# EAGLE design schematic (EAGLE 9.5.2)
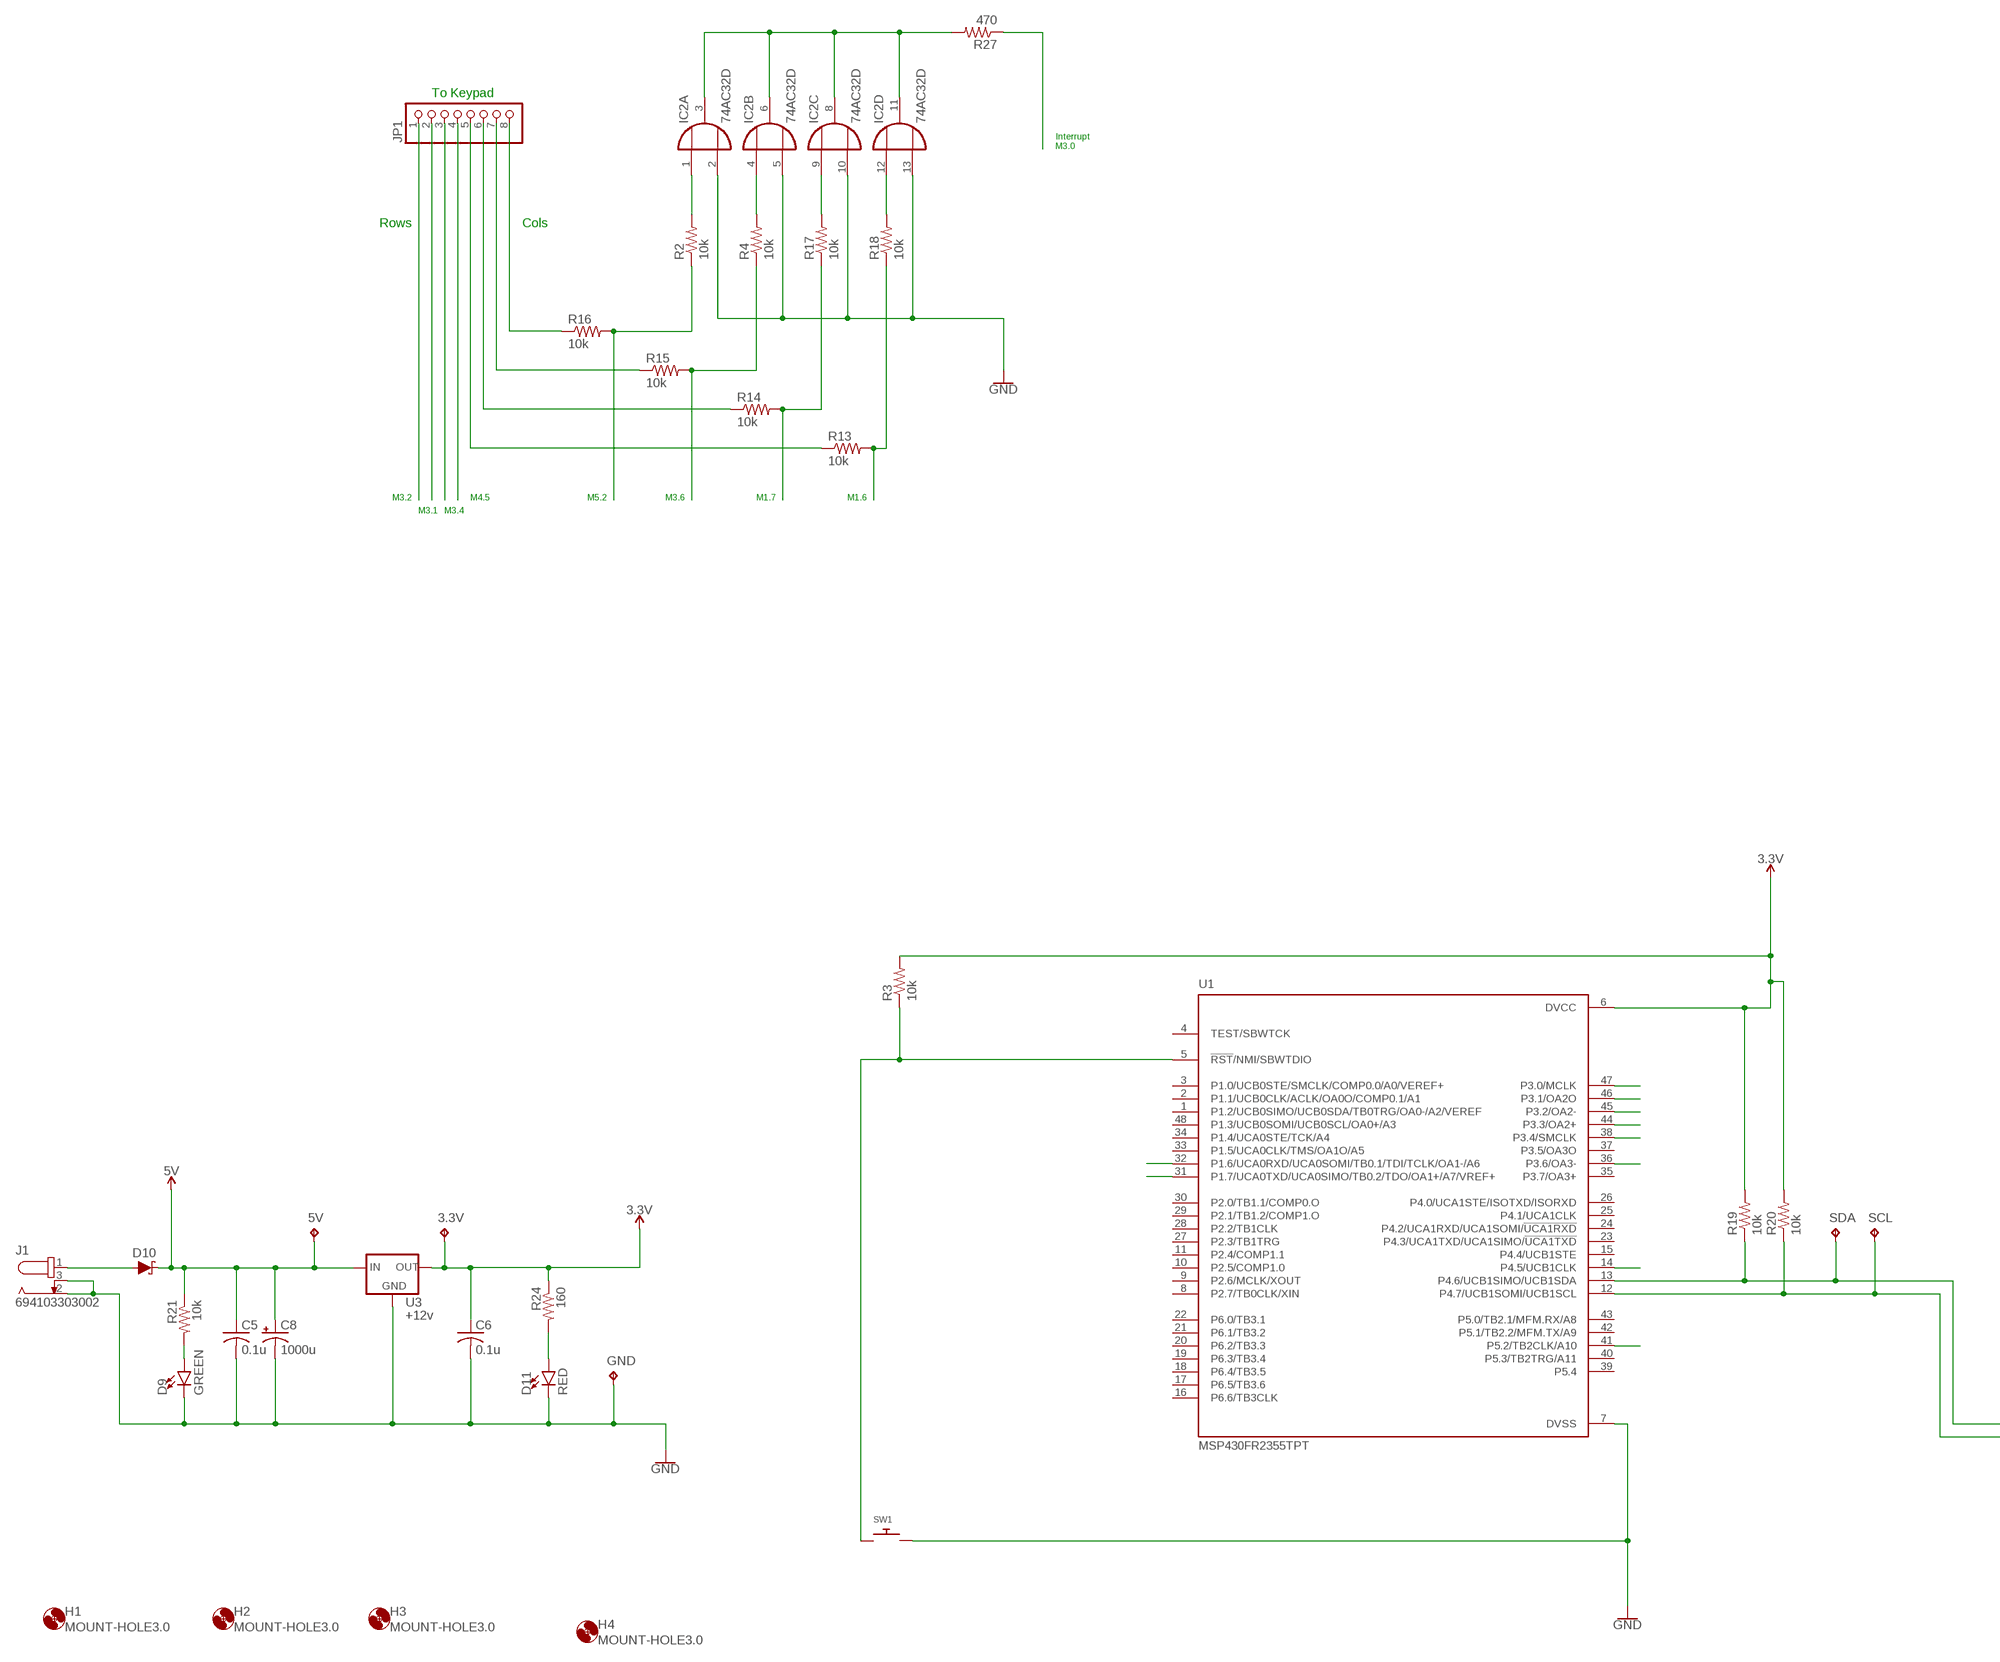
[diagram p0: schematic, sheet 1, part 1 of 2]
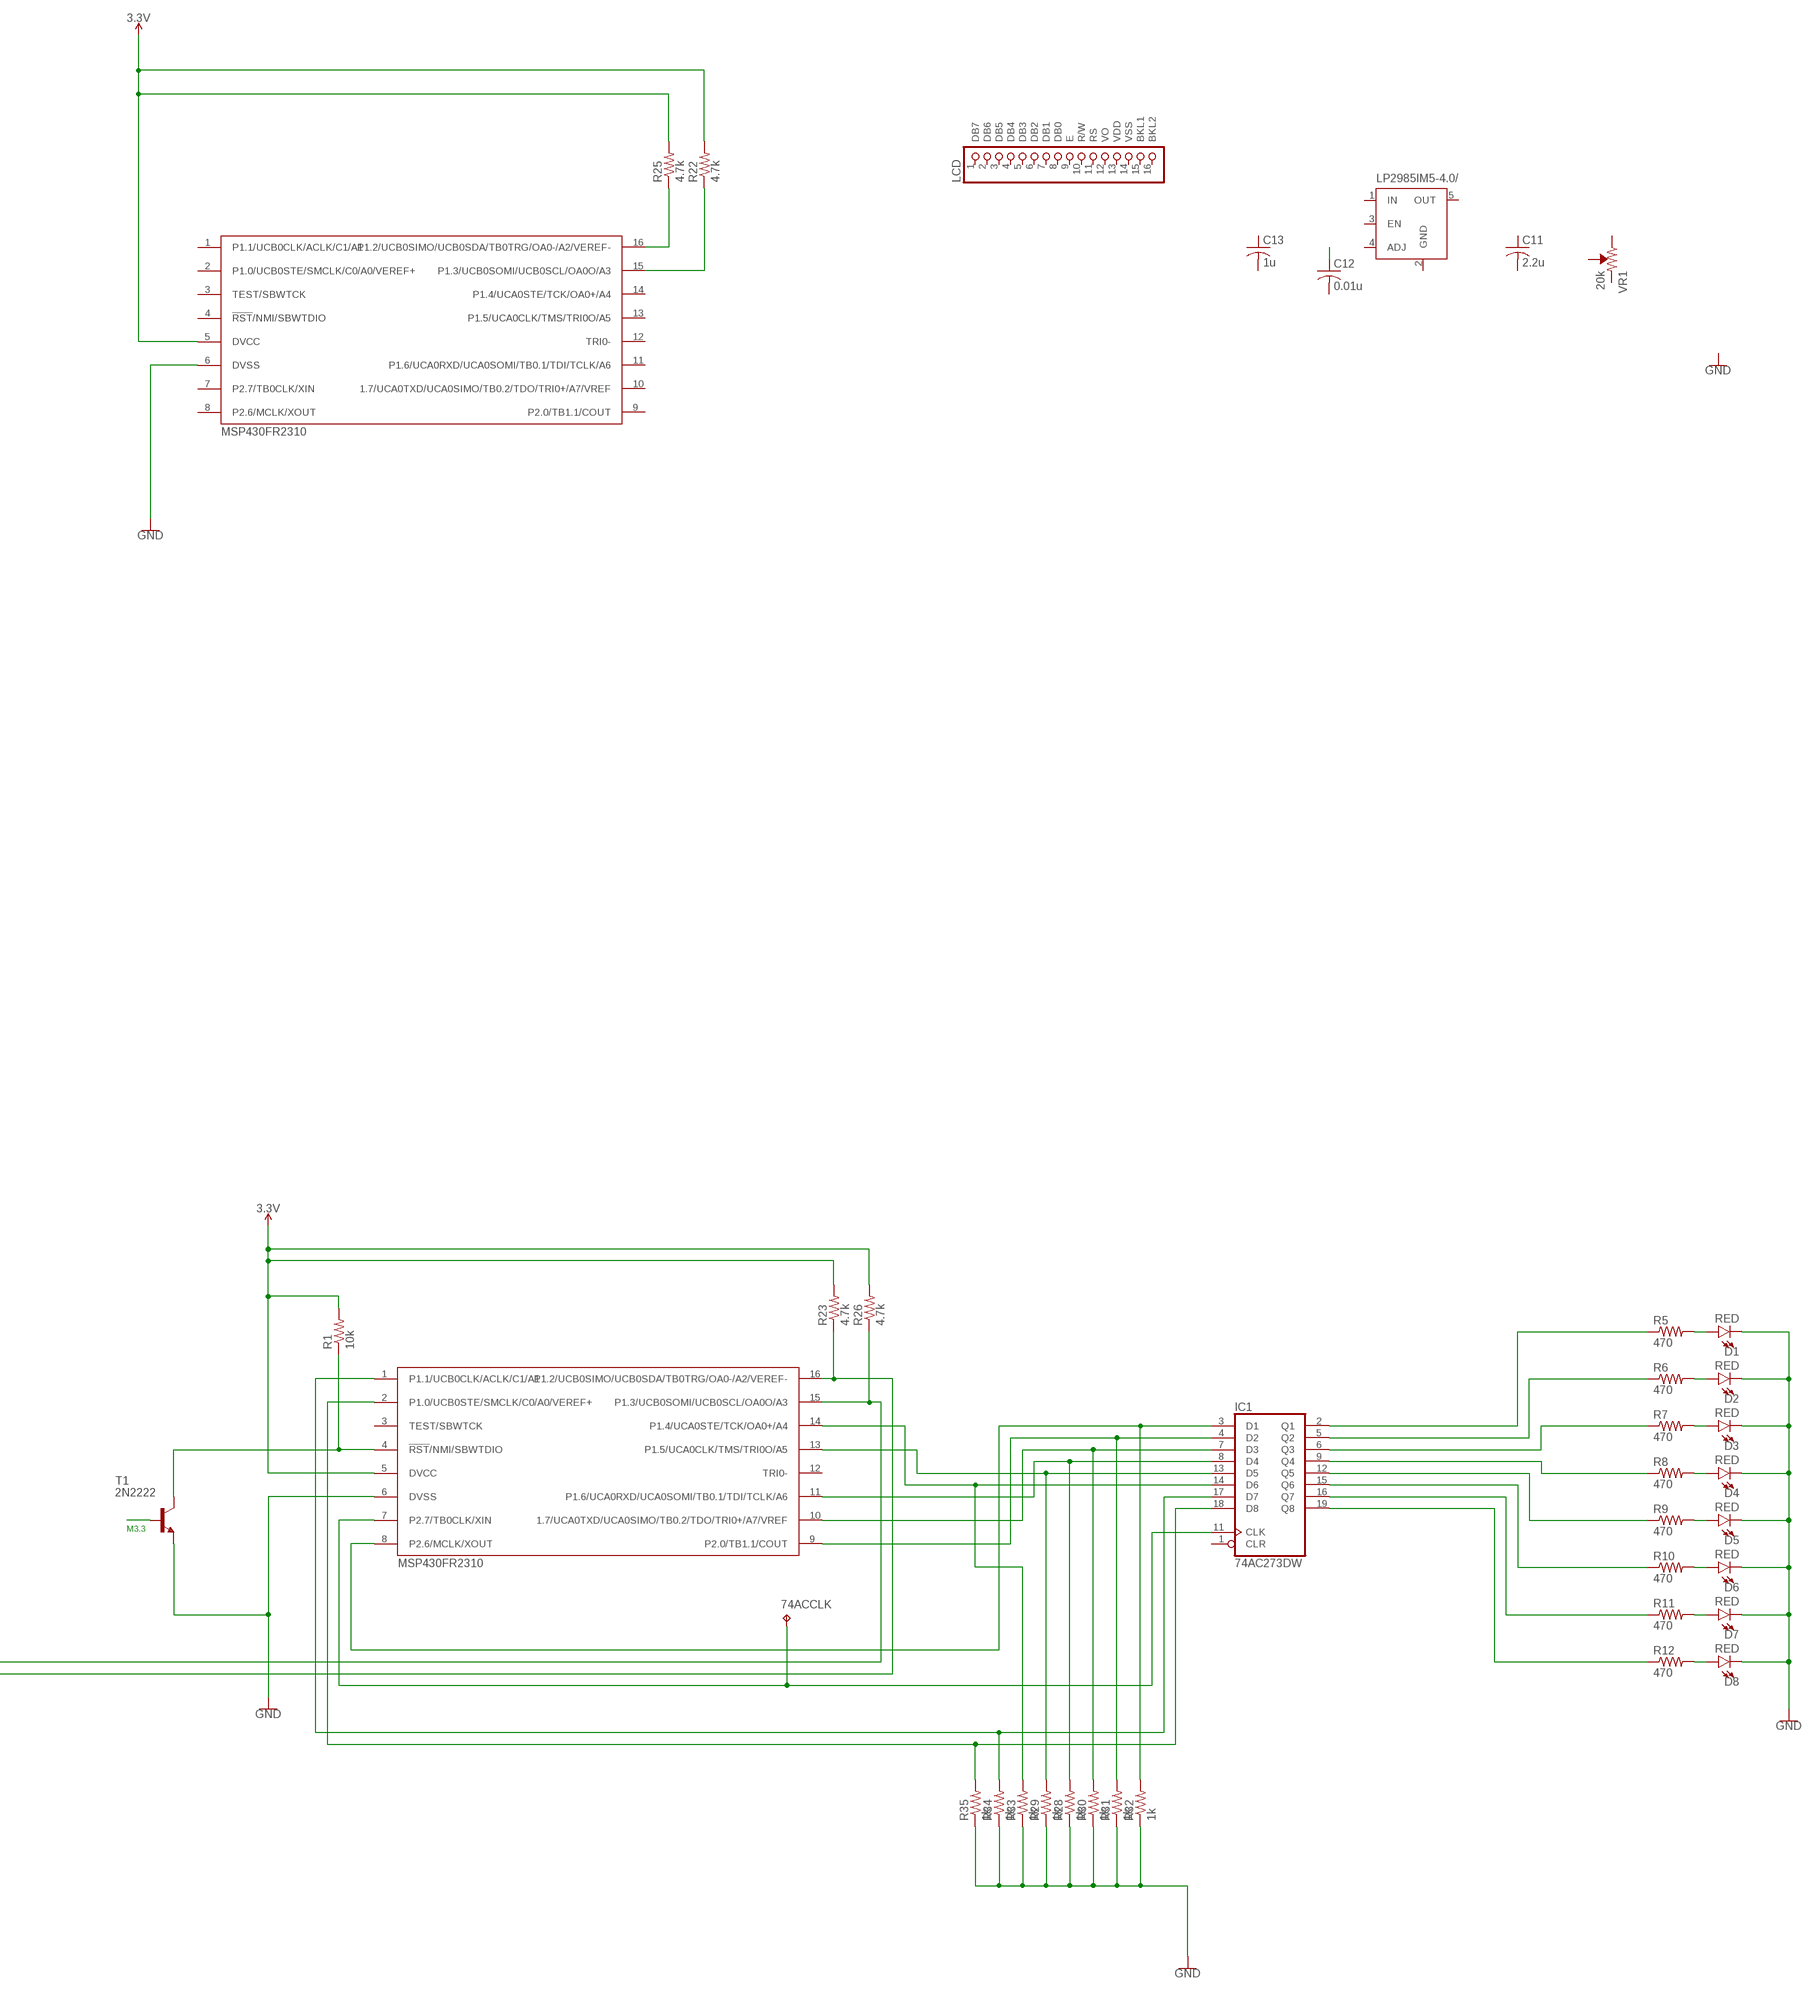
[diagram p1: schematic, sheet 1, part 2 of 2]

## Parts
3.3V  TPPAD1-17  [P1-17]
5V  TPPAD1-17  [P1-17]
74ACCLK  TPPAD1-17  [P1-17]
C5  0.1u  C-USC1206  [C1206]
C6  0.1u  C-USC1206  [C1206]
C8  1000u  CPOL-USE2,5-6E  [E2,5-6E]
C11  2.2u  C-USC0603  [C0603]
C12  0.01u  C-USC0603  [C0603]
C13  1u  C-USC0603  [C0603]
D1  RED  LED-RED1206  [LED-1206]
D2  RED  LED-RED1206  [LED-1206]
D3  RED  LED-RED1206  [LED-1206]
D4  RED  LED-RED1206  [LED-1206]
D5  RED  LED-RED1206  [LED-1206]
D6  RED  LED-RED1206  [LED-1206]
D7  RED  LED-RED1206  [LED-1206]
D8  RED  LED-RED1206  [LED-1206]
D9  GREEN  LED-GREEN1206  [LED-1206]
D10  DIODE-SCHOTTKY-SS14  [SMA-DIODE]
D11  RED  LED-RED1206  [LED-1206]
GND  TPPAD1-17  [P1-17]
H1  MOUNT-HOLE3.0  [3,0]
H2  MOUNT-HOLE3.0  [3,0]
H3  MOUNT-HOLE3.0  [3,0]
H4  MOUNT-HOLE3.0  [3,0]
IC1  74AC273DW  [SO20W]
IC2  74AC32D  [SO14]
J1  694103303002  [694103303002]
JP1  PINHD-1X8/90  [1X08/90]
LCD  PINHD-1X16  [1X16]
LP2985IM5-4.0/  LP2985IM5-4.0/  MIC5219BM5  [SOT23-5]
R1  10k  R-US_CHIP-0603(1608-METRIC)  [RESC1608X60]
R2  10k  R-US_CHIP-1206(3216-METRIC)  [RESC3216X70]
R3  10k  R-US_CHIP-1206(3216-METRIC)  [RESC3216X70]
R4  10k  R-US_CHIP-1206(3216-METRIC)  [RESC3216X70]
R5  470  R-US_CHIP-1206(3216-METRIC)  [RESC3216X70]
R6  470  R-US_CHIP-1206(3216-METRIC)  [RESC3216X70]
R7  470  R-US_CHIP-1206(3216-METRIC)  [RESC3216X70]
R8  470  R-US_CHIP-1206(3216-METRIC)  [RESC3216X70]
R9  470  R-US_CHIP-1206(3216-METRIC)  [RESC3216X70]
R10  470  R-US_CHIP-1206(3216-METRIC)  [RESC3216X70]
R11  470  R-US_CHIP-1206(3216-METRIC)  [RESC3216X70]
R12  470  R-US_CHIP-1206(3216-METRIC)  [RESC3216X70]
R13  10k  R-US_CHIP-1206(3216-METRIC)  [RESC3216X70]
R14  10k  R-US_CHIP-1206(3216-METRIC)  [RESC3216X70]
R15  10k  R-US_CHIP-1206(3216-METRIC)  [RESC3216X70]
R16  10k  R-US_CHIP-1206(3216-METRIC)  [RESC3216X70]
R17  10k  R-US_CHIP-1206(3216-METRIC)  [RESC3216X70]
R18  10k  R-US_CHIP-1206(3216-METRIC)  [RESC3216X70]
R19  10k  R-US_CHIP-1206(3216-METRIC)  [RESC3216X70]
R20  10k  R-US_CHIP-1206(3216-METRIC)  [RESC3216X70]
R21  10k  R-US_CHIP-1206(3216-METRIC)  [RESC3216X70]
R22  4.7k  R-US_CHIP-0603(1608-METRIC)  [RESC1608X60]
R23  4.7k  R-US_CHIP-0603(1608-METRIC)  [RESC1608X60]
R24  160  R-US_CHIP-1206(3216-METRIC)  [RESC3216X70]
R25  4.7k  R-US_CHIP-0603(1608-METRIC)  [RESC1608X60]
R26  4.7k  R-US_CHIP-0603(1608-METRIC)  [RESC1608X60]
R27  470  R-US_CHIP-1206(3216-METRIC)  [RESC3216X70]
R28  1k  R-US_CHIP-1206(3216-METRIC)  [RESC3216X70]
R29  1k  R-US_CHIP-1206(3216-METRIC)  [RESC3216X70]
R30  1k  R-US_CHIP-1206(3216-METRIC)  [RESC3216X70]
R31  1k  R-US_CHIP-1206(3216-METRIC)  [RESC3216X70]
R32  1k  R-US_CHIP-1206(3216-METRIC)  [RESC3216X70]
R33  1k  R-US_CHIP-1206(3216-METRIC)  [RESC3216X70]
R34  1k  R-US_CHIP-1206(3216-METRIC)  [RESC3216X70]
R35  1k  R-US_CHIP-1206(3216-METRIC)  [RESC3216X70]
SCL  TPPAD1-17  [P1-17]
SDA  TPPAD1-17  [P1-17]
SW1  SWITCH_PUSHBUTTONC&K_KSS  [BTN_CK_KSS]
T1  2N2222  [TO92-EBC-OVAL]
U1  MSP430FR2355TPT  [QFP50P900X900X160-48N]
U3  +12v  V_REG_78XX7812  [TO-252]
U$1  MSP430FR2310  [SOP65P640X120-16N]
U$2  MSP430FR2310  [SOP65P640X120-16N]
VR1  20k  TRIMPOT-SMD-3MM-CLOSED-1/8W-20%  [TRIMPOT-SMD-3MM-CLOSED]

## Nets
5V: 5V.TP C5.1 C8.+ D10.C R21.1 U3.1(IN)
GND: C5.2 C6.2 C8.- D1.C D2.C D3.C D4.C D5.C D6.C D7.C D8.C D9.C D11.C GND.TP IC2.2(A:I1) IC2.5(B:I1) IC2.10(C:I1) IC2.13(D:I1) J1.2 J1.3 R28.1 R29.1 R30.1 R31.1 R32.1 R33.1 R34.1 R35.1 SW1.P$2 T1.E U1.7(DVSS) U3.3(GND) U$1.6(DVSS) U$2.6(DVSS)
KEY_COL1: R2.1 R16.2 U1.41(P5.2/TB2CLK/A10)
KEY_COL2: R4.1 R15.2 U1.36(P3.6/OA3-)
KEY_COL3: R14.2 R17.1 U1.31(P1.7/UCA0TXD/UCA0SIMO/TB0.2/TDO/OA1+/A7/VREF+)
KEY_COL4: R13.2 R18.1 U1.32(P1.6/UCA0RXD/UCA0SOMI/TB0.1/TDI/TCLK/OA1-/A6)
KEY_INT: IC2.3(A:O) IC2.6(B:O) IC2.8(C:O) IC2.11(D:O) R27.1 R27.2 U1.47(P3.0/MCLK)
KEY_ROW1: JP1.1 U1.45(P3.2/OA2-)
KEY_ROW2: JP1.2 U1.46(P3.1/OA2O)
KEY_ROW3: JP1.3 U1.38(P3.4/SMCLK)
KEY_ROW4: JP1.4 U1.14(P4.5/UCB1CLK)
LED_RST: T1.B U1.44(P3.3/OA2+)
N$1: R25.1 U$2.16(P1.2/UCB0SIMO/UCB0SDA/TB0TRG/OA0-/A2/VEREF-)
N$2: IC1.18(D8) R35.2 U$1.2(P1.0/UCB0STE/SMCLK/C0/A0/VEREF+)
N$3: R3.1 SW1.P$1 U1.5(!RST!/NMI/SBWTDIO)
N$4: R1.1 T1.C U$1.4(!RST!/NMI/SBWTDIO)
N$5: D1.A R5.2
N$6: D2.A R6.2
N$7: D3.A R7.2
N$8: D4.A R8.2
N$9: D5.A R9.2
N$10: D6.A R10.2
N$11: D7.A R11.2
N$12: D8.A R12.2
N$13: IC1.17(D7) R34.2 U$1.1(P1.1/UCB0CLK/ACLK/C1/A1)
N$14: IC1.14(D6) R33.2 U$1.14(P1.4/UCA0STE/TCK/OA0+/A4)
N$15: IC1.13(D5) R29.2 U$1.13(P1.5/UCA0CLK/TMS/TRI0O/A5)
N$16: IC1.3(D1) R32.2 U$1.8(P2.6/MCLK/XOUT)
N$17: 74ACCLK.TP IC1.11(CLK) U$1.7(P2.7/TB0CLK/XIN)
N$18: IC1.2(Q1) R5.1
N$19: IC1.5(Q2) R6.1
N$20: D11.A R24.2
N$21: IC1.6(Q3) R7.1
N$22: IC1.9(Q4) R8.1
N$23: IC1.12(Q5) R9.1
N$24: IC1.15(Q6) R10.1
N$25: IC1.16(Q7) R11.1
N$26: IC1.19(Q8) R12.1
N$27: IC2.1(A:I0) R2.2
N$29: IC2.4(B:I0) R4.2
N$30: R19.1 R26.1 SDA.TP U1.13(P4.6/UCB1SIMO/UCB1SDA) U$1.15(P1.3/UCB0SOMI/UCB0SCL/OA0O/A3)
N$31: C12.1
N$32: IC2.9(C:I0) R17.2
N$33: IC2.12(D:I0) R18.2
N$38: JP1.8 R16.1
N$39: JP1.7 R15.1
N$40: JP1.6 R14.1
N$41: JP1.5 R13.1
N$45: R22.1 U$2.15(P1.3/UCB0SOMI/UCB0SCL/OA0O/A3)
N$46: D9.A R21.2
N$52: IC1.8(D4) R28.2 U$1.11(P1.6/UCA0RXD/UCA0SOMI/TB0.1/TDI/TCLK/A6)
N$53: IC1.7(D3) R30.2 U$1.10(1.7/UCA0TXD/UCA0SIMO/TB0.2/TDO/TRI0+/A7/VREF)
N$54: IC1.4(D2) R31.2 U$1.9(P2.0/TB1.1/COUT)
N$65: D10.A J1.1
SCL: R20.1 R23.1 SCL.TP U1.12(P4.7/UCB1SOMI/UCB1SCL) U$1.16(P1.2/UCB0SIMO/UCB0SDA/TB0TRG/OA0-/A2/VEREF-)
VDD: 3.3V.TP C6.1 R1.2 R3.2 R19.2 R20.2 R22.2 R23.2 R24.1 R25.2 R26.2 U1.6(DVCC) U3.2(OUT) U$1.5(DVCC) U$2.5(DVCC) ; supply symbol labelled 3.3V
Unconnected: C11.1 C11.2 C12.2 C13.1 C13.2 IC1.1(CLR) LCD.1(DB7) LCD.2(DB6) LCD.3(DB5) LCD.4(DB4) LCD.5(DB3) LCD.6(DB2) LCD.7(DB1) LCD.8(DB0) LCD.9(E) LCD.10(R/W) LCD.11(RS) LCD.12(VO) LCD.13(VDD) LCD.14(VSS) LCD.15(BKL1) LCD.16(BKL2) LP2985IM5-4.0/.1(IN) LP2985IM5-4.0/.3(EN) LP2985IM5-4.0/.4(ADJ) LP2985IM5-4.0/.5(OUT) U1.1(P1.2/UCB0SIMO/UCB0SDA/TB0TRG/OA0-/A2/VEREF) U1.2(P1.1/UCB0CLK/ACLK/OA0O/COMP0.1/A1) U1.3(P1.0/UCB0STE/SMCLK/COMP0.0/A0/VEREF+) U1.4(TEST/SBWTCK) U1.8(P2.7/TB0CLK/XIN) U1.9(P2.6/MCLK/XOUT) U1.10(P2.5/COMP1.0) U1.11(P2.4/COMP1.1) U1.15(P4.4/UCB1STE) U1.16(P6.6/TB3CLK) U1.17(P6.5/TB3.6) U1.18(P6.4/TB3.5) U1.19(P6.3/TB3.4) U1.20(P6.2/TB3.3) U1.21(P6.1/TB3.2) U1.22(P6.0/TB3.1) U1.23(P4.3/UCA1TXD/UCA1SIMO/!UCA1TXD) U1.24(P4.2/UCA1RXD/UCA1SOMI/!UCA1RXD) U1.25(P4.1/UCA1CLK) U1.26(P4.0/UCA1STE/ISOTXD/ISORXD) U1.27(P2.3/TB1TRG) U1.28(P2.2/TB1CLK) U1.29(P2.1/TB1.2/COMP1.O) U1.30(P2.0/TB1.1/COMP0.O) U1.33(P1.5/UCA0CLK/TMS/OA1O/A5) U1.34(P1.4/UCA0STE/TCK/A4) U1.35(P3.7/OA3+) U1.37(P3.5/OA3O) U1.39(P5.4) U1.40(P5.3/TB2TRG/A11) U1.42(P5.1/TB2.2/MFM.TX/A9) U1.43(P5.0/TB2.1/MFM.RX/A8) U1.48(P1.3/UCB0SOMI/UCB0SCL/OA0+/A3) U$1.3(TEST/SBWTCK) U$1.12(TRI0-) U$2.1(P1.1/UCB0CLK/ACLK/C1/A1) U$2.2(P1.0/UCB0STE/SMCLK/C0/A0/VEREF+) U$2.3(TEST/SBWTCK) U$2.4(!RST!/NMI/SBWTDIO) U$2.7(P2.7/TB0CLK/XIN) U$2.8(P2.6/MCLK/XOUT) U$2.9(P2.0/TB1.1/COUT) U$2.10(1.7/UCA0TXD/UCA0SIMO/TB0.2/TDO/TRI0+/A7/VREF) U$2.11(P1.6/UCA0RXD/UCA0SOMI/TB0.1/TDI/TCLK/A6) U$2.12(TRI0-) U$2.13(P1.5/UCA0CLK/TMS/TRI0O/A5) U$2.14(P1.4/UCA0STE/TCK/OA0+/A4) VR1.1(CCW) VR1.2(WIPER) VR1.3(CW)

## Notes on the sheet
- To Keypad
- Interrupt
  M3.0
- Rows | Cols
- M3.2 | M4.5 | M5.2 | M3.6 | M1.7 | M1.6
- M3.1 | M3.4
- M3.3

## Power pins joined to a net without a drawn wire
GND: IC1.10(GND) IC2.7(P:GND) LP2985IM5-4.0/.2(GND)
VCC: IC1.20(VCC) IC2.14(P:VCC)

## Library data of the parts
3.3V 5V 74ACCLK GND SCL SDA = testpad:TP: Test pad
C5 C6 = adafruit:C-US: CAPACITOR, American symbol
C8 = adafruit:CPOL-US: POLARIZED CAPACITOR, American symbol
C11-C13 = rcl:C-US: CAPACITOR, American symbol; SPICEPREFIX: C
D1-D8 D11 = SparkFun-LED:LED-RED: Red SMD LED Used in manufacturing of most products at SparkFun Packages: 0603 - SMD 0603 package [Product Link] <http://docs.avagotech.com/docs/AV02-0551EN> 0603 SMART - SMD 0603 SMART package ( more efficient and expensive)[Product Link] <http://www.osram-os.com/Graphics/XPic2/00077099_0.pdf> 1206 - SMD1206 package [Product Link] <https://www.sparkfun.com/datasheets/DevTools/LilyPad/Q150OVS4.pdff> SparkFun Products: Pro Mini 328 -5V <https://www.sparkfun.com/products/821> RedBoard <https://www.sparkfun.com/products/12757> IOIO-OTG <https://www.sparkfun.com/products/13613>; PROD_ID: DIO-09912
D9 = SparkFun-LED:LED-GREEN: Green SMD LED Used in manufacturing of various products at SparkFun Packages: 0603 - SMD 0603 package [Product Link] <http://www.futureelectronics.com/en/technologies/semiconductors/optoelectronics/leds/Pages/9894312-LTST-C190GKT.aspx?CrossPart=HSMG-C190&IM=0> LilyPad 1206 - SMD1206 LilyPad package [Product Link] <http://www.futureelectronics.com/en/Technologies/Product.aspx?ProductID=IN150NGHARVATEKCORPORATION2049943&IM=0> 1206 - SMD1206 package [Product Link] <http://www.futureelectronics.com/en/technologies/semiconductors/optoelectronics/leds/Pages/8315665-LTST-C150KGKT.aspx?IM=0> 1206 Bottom Mount -SMD 1206 Bottom Mount [Product Link] <http://www.digikey.com/product-detail/en/lite-on-inc/LTST-C230KGKT/160-1456-1-ND/386854> SparkFun Products: Pro Mini 328 -5V <https://www.sparkfun.com/products/821> RedBoard <https://www.sparkfun.com/products/12757> MP3 Trigger <https://www.sparkfun.com/products/13720> Makey Makey <https://www.sparkfun.com/products/11076>; PROD_ID: DIO-00862
D10 = SparkFun-DiscreteSemi:DIODE-SCHOTTKY: Schottky diode A Schottky diode is a semiconductor diode which has a low forward voltage drop and a very fast switching action.; PROD_ID: DIO-08053; VALUE: 1A/40V/500mV
H1-H4 = holes:MOUNT-HOLE: MOUNTING HOLE with drill center marker
IC1 = 74xx-eu:74*273: Octal D type FLIP FLOP, clear
IC2 = 74xx-eu:74*32: Quad 2-input OR gate
J1 = DC Power Jacks:694103303002: CONN PWR JACK 1.05X3.5MM SOLDER Manufacturer's datasheet <https://katalog.we-online.de/em/datasheet/6941xx303002.pdf>; CREATED_BY: PCBLayout.com; DIGIKEY_PART_NUMBER: 732-5925-ND; MANUFACTURER: Wurth Electronics Inc.; MPN: 694103303002
JP1 = Connector:PINHD-1X8: PIN HEADER; CATEGORY: CONNECTOR; SUB-CATEGORY: PIN-HEADER
LCD = LCD:PINHD-1X16: PIN HEADER; CATEGORY: CONNECTOR; SUB-CATEGORY: PIN-HEADER
LP2985IM5-4.0/ = v-reg-micrel:MIC5219BM5: VOLTAGE REGULATOR; MF: ALTERA CORPORATION; MPN: MIC5219BM5 TR; OC_FARNELL: 1100656; OC_NEWARK: 09J8939
R1-R35 = Resistor:R-US: Resistor Fixed - ANSI; CATEGORY: Resistor; SUB-CATEGORY: Fixed
SW1 = adafruit:SWITCH_PUSHBUTTON: Buttons SOFTTOUCHSMD_SJ - Soft touch temporary push button (Super Junk Akihabara) Compatible with SKPMANE010 [Mouser: 688-SKPMAN] C&K_KSS = Digikey: KSS221GLFS
T1 = adafruit:2N2222: NPN TRANSISTOR Big oval pads
U1 = MSP430FR2355TPT:MSP430FR2355TPT: 24MHz 105C ULP Microcontroller With 32 KB FRAM, 4 KB SRAM, 44 IO, 12-bit ADC, 12-bit DACs, OpAmp/PGA 48-LQFP -40 to 105; DESCRIPTION: CPU16 MSP430™ FRAM Microcontroller IC 16-Bit 24MHz 32KB _32K x 8_ FRAM 48-LQFP _7x7_; DIGI-KEY_PART_NUMBER: 296-50260-ND; DIGI-KEY_PURCHASE_URL: https://www.digikey.com/product-detail/en/texas-instruments/MSP430FR2355TPT/296-50260-ND/9597611?utm_source=snapeda&utm_medium=aggregator&utm_campaign=symbol; MF: Texas Instruments; MP: MSP430FR2355TPT; PACKAGE: LQFP-48 Texas Instruments
U3 = SparkFun-IC-Power:V_REG_78XX: Voltage Regulator Standard 78xx regulator. IGO (Input Ground Output). Spark Fun Electronics SKU : COM-00107; PROD_ID: VREG-12370
U$1 U$2 = MSP430FR2310:MSP430FR2310; MSP: MSP430FR2310
VR1 = SparkFun-Resistors:TRIMPOT: Trimming Potentiometer (Trimpot) Three-terminal potentiometers, with an adjustable wiper and two adjustable resistors. A pot can be used to create a configurable voltage divider, or as a variable resistor. "Trimpots" are a subset of potentiometers, usually intended for "set-and-forget" applications. They're often more delicate than standard potentiometers - rated for fewer turns. Variants PTH-KNOB - PTH Trimpot w/ finger-adjustable knob Trimpot 10K with Knob <https://www.sparkfun.com/products/9806> (COM-09806) Datasheet <http://www.sparkfun.com/datasheets/Components/General/TSR-3386.pdf> SMD-3MM-CLOSED-FRAME - SMD 3mm Square Closed-Frame Trimpot Used on e.g. EasyDriver - Stepper Motor Driver <https://www.sparkfun.com/products/12779> Datasheet <http://www.bitechnologies.com/pdfs/22.pdf> (22AR10KTR) SMD-5MM - SMD 5mm Square Closed-Frame Trimpot Used on e.g. IOIO-OTG - V2.2 <https://www.sparkfun.com/products/13613> Datasheet <http://www.vishay.com/docs/51008/ts53.pdf> (TS53YL502MR10) SMD-3MM-1/10W-25% - 3mm Square Open-Frame Trimpot Used on e.g. SparkFun Shapeoko <https://www.sparkfun.com/products/13899> Datasheet <http://www.bourns.com/docs/Product-Datasheets/TC33.pdf> (TC33X-2-103E); PROD_ID: RES-09285; VALUE: 10k

## Board
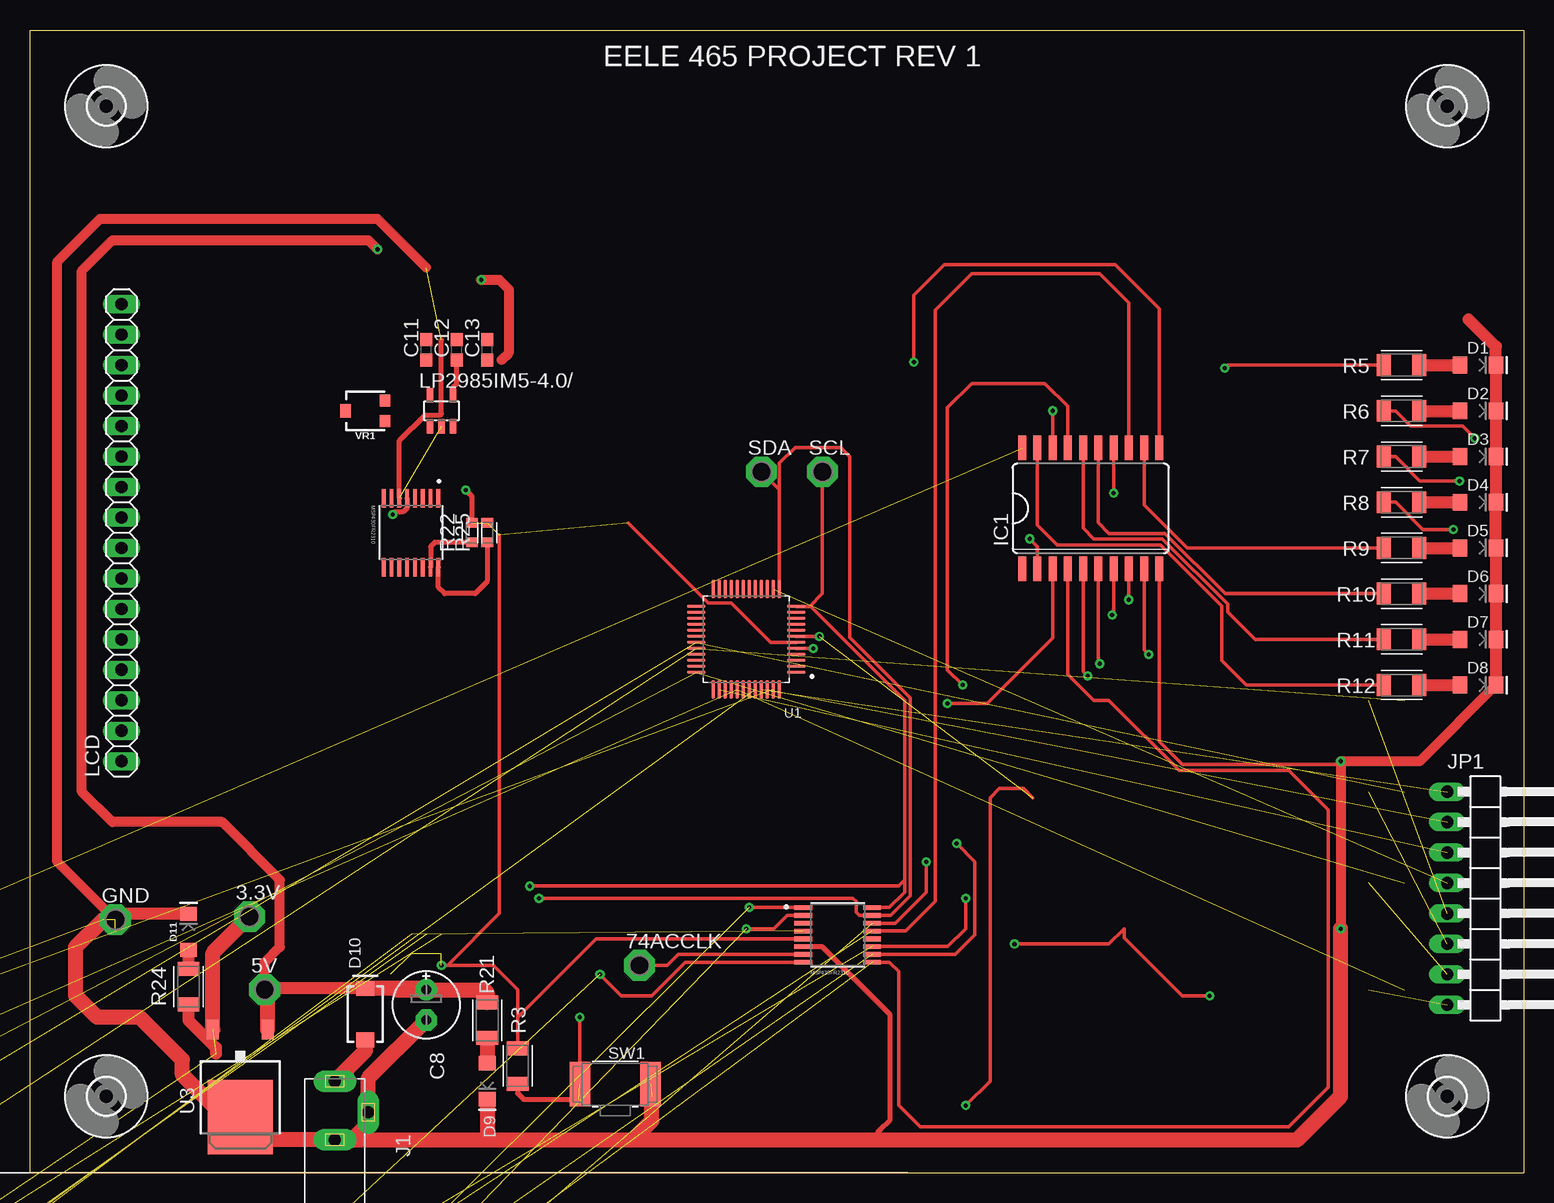
[diagram p2: board, top side]
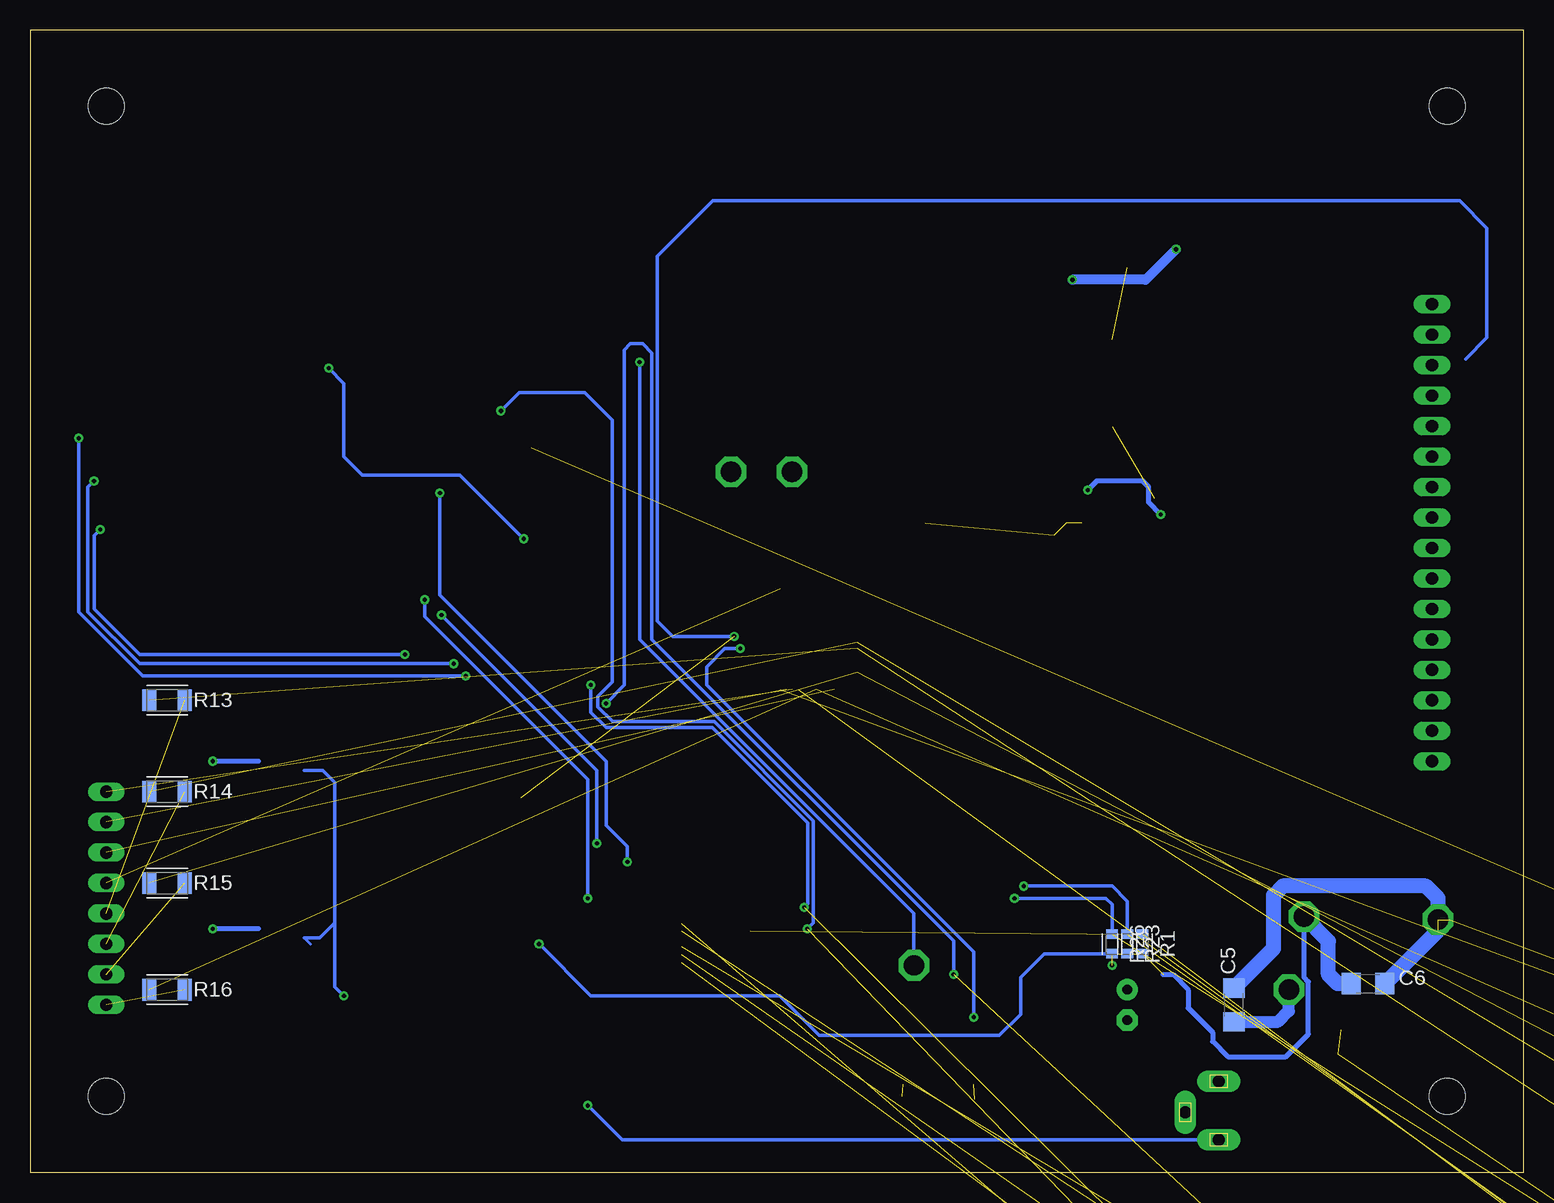
[diagram p3: board, bottom side, seen from below]

Size 124.46 x 95.25 mm. Coordinates in mm from the lower left corner, seen from the top.
Outline: 0,0 0,95.25 124.46,95.25 124.46,0 0,0
Copper layers (1*16): Top 0.035mm / dielectric 1.5mm / Bottom 0.035mm
Design rules "default": minimum track width 6mil, minimum drill 0.35mm, track to track 6mil, track to pad 6mil, pad to pad 6mil, via to via 6mil, smd to smd 6mil, copper to edge 40mil, drill to drill 6mil, minimum pad ring 10mil, minimum via ring 8mil, stop-mask expansion 4mil, vias tented up to drill 0mil, thermal gap 10mil

### Footprints (pad centres in the part's own frame; a part is rotated, then mirrored left to right if it is on the bottom)
P1-17 = drill 1.702 pad 2.54 octagon: TP 0,0
C1206 = smd 1.6 x 1.8: 1 -1.4,0; 2 1.4,0
E2,5-6E = drill 0.813 pad 1.778: + -1.27,0 | drill 0.813 pad 1.778 octagon: - 1.27,0
C0603 = smd 1.1 x 1: 1 -0.85,0; 2 0.85,0
LED-1206 = smd 1.2 x 1.4: A -1.5,0; C 1.5,0
SMA-DIODE = smd 1.27 x 1.47: A -2.15,0; C 2.15,0
3,0 = hole 3: 0,0
SO20W = smd 0.66 x 2.032: 1 -5.715,-5.029; 2 -4.445,-5.029; 3 -3.175,-5.029; 4 -1.905,-5.029; 5 -0.635,-5.029; 6 0.635,-5.029; 7 1.905,-5.029; 8 3.175,-5.029; 9 4.445,-5.029; 10 5.715,-5.029; 11 5.715,5.029; 12 4.445,5.029; 13 3.175,5.029; 14 1.905,5.029; 15 0.635,5.029; 16 -0.635,5.029; 17 -1.905,5.029; 18 -3.175,5.029; 19 -4.445,5.029; 20 -5.715,5.029
SO14 = smd 0.66 x 2.032: 1 -3.81,-3.073; 2 -2.54,-3.073; 3 -1.27,-3.073; 4 0,-3.073; 5 1.27,-3.073; 6 2.54,-3.073; 7 3.81,-3.073; 8 3.81,3.073; 9 2.54,3.073; 10 1.27,3.073; 11 0,3.073; 12 -1.27,3.073; 13 -2.54,3.073; 14 -3.81,3.073
694103303002 = drill 1 pad 1.8 long: 1 0,0; 2 -4.9,0; 3 -2.6,-2.8
1X08/90 = drill 1.016 long: 1 -8.89,-3.81; 2 -6.35,-3.81; 3 -3.81,-3.81; 4 -1.27,-3.81; 5 1.27,-3.81; 6 3.81,-3.81; 7 6.35,-3.81; 8 8.89,-3.81
1X16 = drill 1.016 long: 1 -19.05,0; 2 -16.51,0; 3 -13.97,0; 4 -11.43,0; 5 -8.89,0; 6 -6.35,0; 7 -3.81,0; 8 -1.27,0; 9 1.27,0; 10 3.81,0; 11 6.35,0; 12 8.89,0; 13 11.43,0; 14 13.97,0; 15 16.51,0; 16 19.05,0
SOT23-5 = smd 0.55 x 1.2: 1 -0.95,-1.3; 2 0,-1.3; 3 0.95,-1.3; 4 0.95,1.3; 5 -0.95,1.3
RESC1608X60 = smd 0.799 x 0.974: 1 -0.815,0; 2 0.815,0
RESC3216X70 = smd 1.165 x 1.815: 1 -1.475,0; 2 1.475,0
BTN_CK_KSS = smd 1.7 x 3.7: P$1 -2.95,0; P$2 2.95,0
TO92-EBC-OVAL = drill 0.813 long: B 0,-1.27; C 2.54,-1.27; E -2.54,-1.27
QFP50P900X900X160-48N = smd 1.56 x 0.28: 1 -4.18,2.75; 2 -4.18,2.25; 3 -4.18,1.75; 4 -4.18,1.25; 5 -4.18,0.75; 6 -4.18,0.25; 7 -4.18,-0.25; 8 -4.18,-0.75; 9 -4.18,-1.25; 10 -4.18,-1.75; 11 -4.18,-2.25; 12 -4.18,-2.75; 25 4.18,-2.75; 26 4.18,-2.25; 27 4.18,-1.75; 28 4.18,-1.25; 29 4.18,-0.75; 30 4.18,-0.25; 31 4.18,0.25; 32 4.18,0.75; 33 4.18,1.25; 34 4.18,1.75; 35 4.18,2.25; 36 4.18,2.75 | smd 0.28 x 1.56: 13 -2.75,-4.18; 14 -2.25,-4.18; 15 -1.75,-4.18; 16 -1.25,-4.18; 17 -0.75,-4.18; 18 -0.25,-4.18; 19 0.25,-4.18; 20 0.75,-4.18; 21 1.25,-4.18; 22 1.75,-4.18; 23 2.25,-4.18; 24 2.75,-4.18; 37 2.75,4.18; 38 2.25,4.18; 39 1.75,4.18; 40 1.25,4.18; 41 0.75,4.18; 42 0.25,4.18; 43 -0.25,4.18; 44 -0.75,4.18; 45 -1.25,4.18; 46 -1.75,4.18; 47 -2.25,4.18; 48 -2.75,4.18
TO-252 = smd 1 x 1.6: 1 -2.28,-4.8; 2 2.28,-4.8 | smd 5.4 x 6.2: 3 0,2.5
SOP65P640X120-16N = smd 1.57 x 0.41: 1 -2.87,2.275; 2 -2.87,1.625; 3 -2.87,0.975; 4 -2.87,0.325; 5 -2.87,-0.325; 6 -2.87,-0.975; 7 -2.87,-1.625; 8 -2.87,-2.275; 9 2.87,-2.275; 10 2.87,-1.625; 11 2.87,-0.975; 12 2.87,-0.325; 13 2.87,0.325; 14 2.87,0.975; 15 2.87,1.625; 16 2.87,2.275
TRIMPOT-SMD-3MM-CLOSED = smd 1 x 0.9: 1 -0.85,-1.65; 3 0.85,-1.65 | smd 1.1 x 0.9: 2 0,1.65

### Placement (x,y rotation side)
3.3V  18.29,21.34 0 top
5V  19.56,15.24 0 top
74ACCLK  50.8,17.27 0 top
C5  24.13,13.97 90 bottom
C6  12.95,15.75 0 bottom
C8  33.02,13.97 270 top
C11  33.02,68.58 90 top
C12  35.56,68.58 90 top
C13  38.1,68.58 90 top
D1  120.65,67.31 0 top
D2  120.65,63.5 0 top
D3  120.65,59.69 0 top
D4  120.65,55.88 0 top
D5  120.65,52.07 0 top
D6  120.65,48.26 0 top
D7  120.65,44.45 0 top
D8  120.65,40.64 0 top
D9  38.1,7.62 270 top
D10  27.94,13.21 90 top
D11  13.21,20.07 90 top
GND  7.11,21.08 0 top
H1  118.11,88.9 0 top
H2  6.35,88.9 0 top
H3  118.11,6.35 0 top
H4  6.35,6.35 0 top
IC1  88.39,55.37 0 top
IC2  -66.29,-8.64 0 top  (outside the outline)
J1  25.4,7.62 90 top
JP1  121.92,22.86 270 top
LCD  7.62,53.34 90 top
LP2985IM5-4.0/  34.29,63.5 0 top
R1  31.75,19.05 270 bottom
R2  -69.09,-16.76 0 top  (outside the outline)
R3  40.64,8.89 90 top
R4  -69.09,-24.13 0 top  (outside the outline)
R5  114.3,67.31 0 top
R6  114.3,63.5 0 top
R7  114.3,59.69 0 top
R8  114.3,55.88 0 top
R9  114.3,52.07 0 top
R10  114.3,48.26 0 top
R11  114.3,44.45 0 top
R12  114.3,40.64 0 top
R13  113.03,39.37 180 bottom
R14  113.03,31.75 180 bottom
R15  113.03,24.13 180 bottom
R16  113.03,15.24 180 bottom
R17  -69.09,-31.5 0 top  (outside the outline)
R18  -69.09,-38.86 0 top  (outside the outline)
R19  -69.09,-46.23 0 top  (outside the outline)
R20  -69.09,-53.59 0 top  (outside the outline)
R21  38.1,12.7 270 top
R22  36.83,53.34 90 top
R23  33.02,19.05 270 bottom
R24  13.21,15.49 90 top
R25  38.1,53.34 90 top
R26  34.29,19.05 270 bottom
R27  -69.09,-60.96 0 top  (outside the outline)
R28  -77.22,-68.33 0 top  (outside the outline)
R29  -77.22,-75.69 0 top  (outside the outline)
R30  -77.22,-83.06 0 top  (outside the outline)
R31  -77.22,-90.42 0 top  (outside the outline)
R32  -77.22,-97.79 0 top  (outside the outline)
R33  -77.22,-105.16 0 top  (outside the outline)
R34  -77.22,-112.52 0 top  (outside the outline)
R35  -77.22,-119.89 0 top  (outside the outline)
SCL  66.04,58.42 0 top
SDA  60.96,58.42 0 top
SW1  48.77,7.37 0 top
T1  -77.98,-59.18 0 top  (outside the outline)
U1  59.69,44.45 180 top
U3  17.53,7.11 180 top
U$1  67.31,19.81 0 top
U$2  31.75,53.34 270 top
VR1  27.94,63.5 90 top

### Tracks (layer width: path | path; a pad name or v marks a point on that pad's centre or on a via)
5V  (via drill 0.35 pad 0.55)
  Top 0.813: 5V.TP 19.56,17.53 20.83,18.8 20.83,24.38 16,29.21 6.86,29.21 4.32,31.75 4.32,75.18 6.86,77.72 28.19,77.72 v28.96,76.96 | v37.59,74.42 39.12,74.42 39.88,73.66 39.88,68.33 39.28,67.73
  Top 1.016: D10.C 19.68,15.36 5V.TP
  Top 1.27: U3.1 19.81,14.99 5V.TP | 30.48,15.24 C8.+ | C8.+ 37.85,15.24 38.1,14.99 R21.1 | D10.C 32.9,15.36 C8.+
  Bottom 0.813: v28.96,76.96 31.5,74.42 v37.59,74.42
  Bottom 1.016: C5.1 20.45,12.57 19.56,13.46 5V.TP
GND  (via drill 0.35, 0.35 pad 0.55)  (20 unrouted)
  Top 0.305: 70.87,3.56 70.03,2.72 69.85,2.72 | IC1.10 94.11,35.94 96.01,34.04 108.97,34.04 v109.22,34.29 | 83.57,31.24 82.8,32 80.77,32 80.01,31.24 80.01,7.62 v77.98,5.59 | U1.7 v65.79,44.7
  Top 0.406: U$1.6 66,18.84 71.63,13.21 71.63,4.32 70.87,3.56 70.61,3.3 | 34.29,69.43 34.29,63.25 34.2,63.16 32.92,63.16 30.77,61.01 U$2.6
  Top 0.813: D8.C 115.8,34.29 v109.22,34.29 v109.22,20.32 | GND.TP 2.29,25.91 2.29,75.95 5.84,79.5 28.96,79.5 33.02,75.44
  Top 1.016: D8.C D7.C D6.C D5.C D4.C D3.C D2.C D1.C 122.15,68.86 119.89,71.12 | D11.C 7.6,21.57 GND.TP
  Top 1.27: J1.2 25.47,2.79 26.92,2.79 28.2,4.07 J1.3 28.2,7.88 C8.- | J1.2 19.42,2.72 | 19.42,2.72 18.36,2.72 18.29,2.79 | J1.2 38.1,2.72 | 38.1,2.72 50.22,2.72 | 51.82,6.35 51.82,4.32 50.22,2.72 | D9.C 38.1,2.72 | 6.1,21.08 3.81,18.8 3.81,14.73 5.59,12.95 9.14,12.95 12.7,9.4 12.7,8.13 16.22,4.61 U3.3 19.42,2.72 | 50.22,2.72 69.85,2.72 105.59,2.72 109.22,6.35 v109.22,20.32
  Bottom 0.305: v77.98,5.59 75.11,2.72 J1.2 | v65.79,44.7 70.92,44.7 72.19,45.97 72.19,76.4 67.56,81.03 5.33,81.03 3.05,78.74 3.05,69.6 4.83,67.82
  Bottom 0.406: 105.41,34.29 v109.22,34.29 | 105.41,20.32 v109.22,20.32
  Bottom 1.27: C6.2 7.11,20.19 | C5.2 20.83,18.67 20.83,23.11 20.07,23.88 8.13,23.88 7.11,22.86 GND.TP
KEY_COL1  (2 unrouted)
KEY_COL2  (2 unrouted)
KEY_COL3  (2 unrouted)
KEY_COL4  (2 unrouted)
KEY_INT  (6 unrouted)
KEY_ROW1  (1 unrouted)
KEY_ROW2  (1 unrouted)
KEY_ROW3  (1 unrouted)
KEY_ROW4  (1 unrouted)
LED_RST  (1 unrouted)
N$1
  Top 0.406: R25.1 38.1,49.28 37.08,48.26 34.54,48.26 34.02,48.78 U$2.16
N$2  (via drill 0.35 pad 0.55)  (1 unrouted)
  Top 0.305: U$1.2 63.09,21.44 61.98,20.32 v59.69,20.32 | IC1.18 v85.22,63.5
  Bottom 0.305: v59.69,20.32 59.18,20.83 59.18,29.32 67.45,37.59 75.9,37.59 77.14,38.83 77.14,39.7 75.95,40.89 75.95,62.74 78.23,65.02 83.69,65.02 v85.22,63.5
N$3  (via drill 0.35 pad 0.55)  (1 unrouted)
  Top 0.305: SW1.P$1 v45.82,12.95 | U1.5 65.27,43.7 v65.28,43.69
  Top 0.406: R3.1 40.64,6.6 41.15,6.1 45.72,6.1
  Bottom 0.305: v65.28,43.69 66.55,43.69 68.07,42.16 68.07,40.64 45.82,18.39 v45.82,12.95
N$4  (2 unrouted)
N$5
  Top 1.016: R5.2 D1.A
N$6
  Top 1.016: R6.2 D2.A
N$7
  Top 1.016: R7.2 D3.A
N$8
  Top 1.016: R8.2 D4.A
N$9
  Top 1.016: R9.2 D5.A
N$10
  Top 1.016: R10.2 D6.A
N$11
  Top 1.016: R11.2 D7.A
N$12
  Top 1.016: R12.2 D8.A
N$13  (via drill 0.35 pad 0.55)  (1 unrouted)
  Top 0.305: IC1.17 86.49,63.88 84.58,65.79 78.49,65.79 76.45,63.75 76.45,41.91 v77.72,40.64 | v59.94,22.1 U$1.1
  Bottom 0.305: v77.72,40.64 77.72,38.35 76.45,37.08 67.59,37.08 59.64,29.14 59.64,22.4 v59.94,22.1
N$14  (via drill 0.35 pad 0.55)  (1 unrouted)
  Top 0.305: IC1.14 v90.3,56.64 | v74.68,25.91 74.68,23.37 72.09,20.79 U$1.14
  Bottom 0.305: v90.3,56.64 90.3,48.13 76.45,34.29 76.45,28.96 74.68,27.18 v74.68,25.91
N$15  (1 unrouted)
  Top 0.305: IC1.13 91.57,72.52 89.15,74.93 78.49,74.93 75.44,71.88 75.44,22.61 72.97,20.14 U$1.13
N$16  (via drill 0.35 pad 0.55)  (1 unrouted)
  Top 0.305: U$1.8 54.62,17.54 51.82,14.73 49.28,14.73 v47.5,16.51 | IC1.3 85.22,44.58 79.76,39.12 v76.45,39.12
  Bottom 0.305: v47.5,16.51 47.5,19.3 72.64,44.45 72.64,68.33 73.41,69.09 74.42,69.09 74.93,68.58 74.93,40.64 v76.45,39.12
N$17  (via drill 0.35 pad 0.55)
  Top 0.305: U$1.7 54,18.19 53.09,17.27 74ACCLK.TP | IC1.11 94.11,72.01 90.42,75.69 76.2,75.69 73.66,73.15 v73.66,67.56
  Bottom 0.305: v73.66,67.56 73.66,44.45 50.8,21.59 74ACCLK.TP
N$18  (via drill 0.35 pad 0.55)
  Top 0.305: IC1.2 83.95,52.2 v83.31,52.83 | v99.57,67.06 99.82,67.31 R5.1
  Bottom 0.305: v83.31,52.83 88.65,58.17 96.77,58.17 98.3,59.69 98.3,65.79 v99.57,67.06
N$19  (via drill 0.35 pad 0.55)
  Top 0.305: IC1.5 87.76,41.78 v88.14,41.4 | v120.4,61.21 119.38,62.23 115.06,62.23 113.79,63.5 R6.1
  Bottom 0.305: v88.14,41.4 115.06,41.4 120.4,46.74 v120.4,61.21
N$20
  Top 1.016: D11.A R24.2
N$21  (via drill 0.35 pad 0.55)
  Top 0.305: IC1.6 89.03,42.55 v89.15,42.42 | v119.13,57.66 115.82,57.66 113.79,59.69 R7.1
  Bottom 0.305: v89.15,42.42 115.32,42.42 119.63,46.74 119.63,57.15 v119.13,57.66
N$22  (via drill 0.35 pad 0.55)
  Top 0.305: IC1.9 92.84,43.56 v93.22,43.18 | v118.62,53.59 116.08,53.59 113.79,55.88 R8.1
  Bottom 0.305: v93.22,43.18 115.32,43.18 119.13,46.99 119.13,53.09 v118.62,53.59
N$23
  Top 0.305: IC1.12 92.84,55.66 96.43,52.07 R9.1
N$24
  Top 0.305: IC1.15 89.03,54.18 89.92,53.29 94.56,53.29 99.59,48.26 R10.1
N$25
  Top 0.305: IC1.16 87.76,53.72 88.65,52.83 94.37,52.83 99.82,47.38 99.82,46.74 102.11,44.45 R11.1
N$26
  Top 0.305: 112.47,41 R12.1 101.35,40.64 99.31,42.67 99.31,47.24 94.23,52.32 85.6,52.32 83.95,53.98 IC1.19
N$27  (1 unrouted)
N$29  (1 unrouted)
N$30  (via drill 0.35 pad 0.55)  (1 unrouted)
  Top 0.305: SDA.TP 62.44,56.94 U1.13 62.44,59.14 63.75,60.45 67.56,60.45 68.33,59.69 68.33,44.59 73.36,39.56 73.36,23.06 71.73,21.44 U$1.15 69.09,21.44 68.83,21.69 68.83,22.61 68.58,22.86 v42.42,22.86
  Bottom 0.305: v42.42,22.86 34.8,22.86 34.29,22.35 R26.1
N$31
  Top 0.406: 35.24,65.47 35.56,65.79 C12.1
N$32  (1 unrouted)
N$33  (1 unrouted)
N$38  (1 unrouted)
N$39  (1 unrouted)
N$40  (1 unrouted)
N$41  (1 unrouted)
N$45
  Top 0.406: R22.1 33.73,52.52 33.38,52.17 U$2.15
N$46
  Top 1.27: R21.2 D9.A
N$52  (via drill 0.35 pad 0.55)  (1 unrouted)
  Top 0.305: IC1.8 v91.57,47.75 | v77.98,22.86 77.98,20.32 76.5,18.84 U$1.11
  Bottom 0.305: v91.57,47.75 91.57,46.35 77.98,32.77 v77.98,22.86
N$53  (via drill 0.35 pad 0.55)  (1 unrouted)
  Top 0.305: IC1.7 90.3,46.61 v90.17,46.48 | v77.22,27.43 78.74,25.91 78.74,19.81 77.11,18.19 U$1.10
  Bottom 0.305: v90.17,46.48 77.22,33.53 v77.22,27.43
N$54  (1 unrouted)
  Top 0.305: U$1.9 71.62,17.54 72.39,16.76 72.39,5.59 74.17,3.81 104.9,3.81 108.2,7.11 108.2,30.23 104.9,33.53 95.76,33.53 89.92,39.37 88.65,39.37 86.49,41.53 IC1.4
N$65
  Top 1.27: J1.1 27.94,10.16 D10.A
SCL  (via drill 0.35 pad 0.55)  (1 unrouted)
  Top 0.305: SCL.TP 66.04,48.26 64.98,47.2 U1.12 65.07,47.2 72.9,39.37 72.9,24.38 | U$1.16 71.62,22.09 72.9,23.37 72.9,24.38 | 72.9,24.38 72.39,23.88 v41.66,23.88
  Bottom 0.305: R23.1 33.02,22.61 34.29,23.88 v41.66,23.88
VCC  (1 unrouted)
VDD  (via drill 0.35 pad 0.55)  (10 unrouted)
  Top 0.305: 40.64,12.95 47.17,19.49 U$1.5 | 40.64,12.95 R3.2 | 40.64,12.95 40.64,15.24 38.61,17.27 v34.29,17.27 34.8,17.27 39.12,21.59 39.12,53.14 | U1.6 61.72,44.2 58.42,47.5 56.52,47.5 49.87,54.16 | v82.04,19.05 89.92,19.05 91.19,20.32 91.19,19.56 96.01,14.73 v98.3,14.73
  Top 0.406: 40.69,10.41 R3.2 | v30.23,54.86 30.43,55.07 31.1,55.07 31.43,55.4 U$2.5 | v36.32,56.9 36.83,56.39 R22.2
  Top 1.016: R24.1 13.21,12.7 15.49,10.41 15.49,9.91
  Top 1.27: U3.2 15.25,18.29 3.3V.TP
  Bottom 0.254: 101.6,19.56 101.09,19.05
  Bottom 0.305: v82.04,19.05 77.72,14.73 61.98,14.73 58.67,11.43 43.69,11.43 41.91,13.21 41.91,16.26 39.93,18.23 R26.2 | 101.6,19.56 100.33,19.56 99.06,20.83 | 101.6,33.53 100.08,33.53 99.06,32.51 99.06,20.83 | 99.06,20.83 99.06,15.49 v98.3,14.73
  Bottom 0.406: 30.02,16.51 29.21,16.51 27.94,15.24 27.94,13.72 25.91,11.68 25.91,10.92 24.64,9.65 19.81,9.65 17.93,11.54 17.93,15.92 18.29,16.28 3.3V.TP | v30.23,54.86 31.24,55.88 31.24,57.15 31.75,57.66 35.56,57.66 v36.32,56.9
  Bottom 1.27: C6.1 15.49,15.75 16.26,16.51 16.26,19.3 3.3V.TP

### Text on the board
tNames: EELE 465 PROJECT REV 1